# Altium schematic sheet [05] - FLASH.SchDoc
size A3
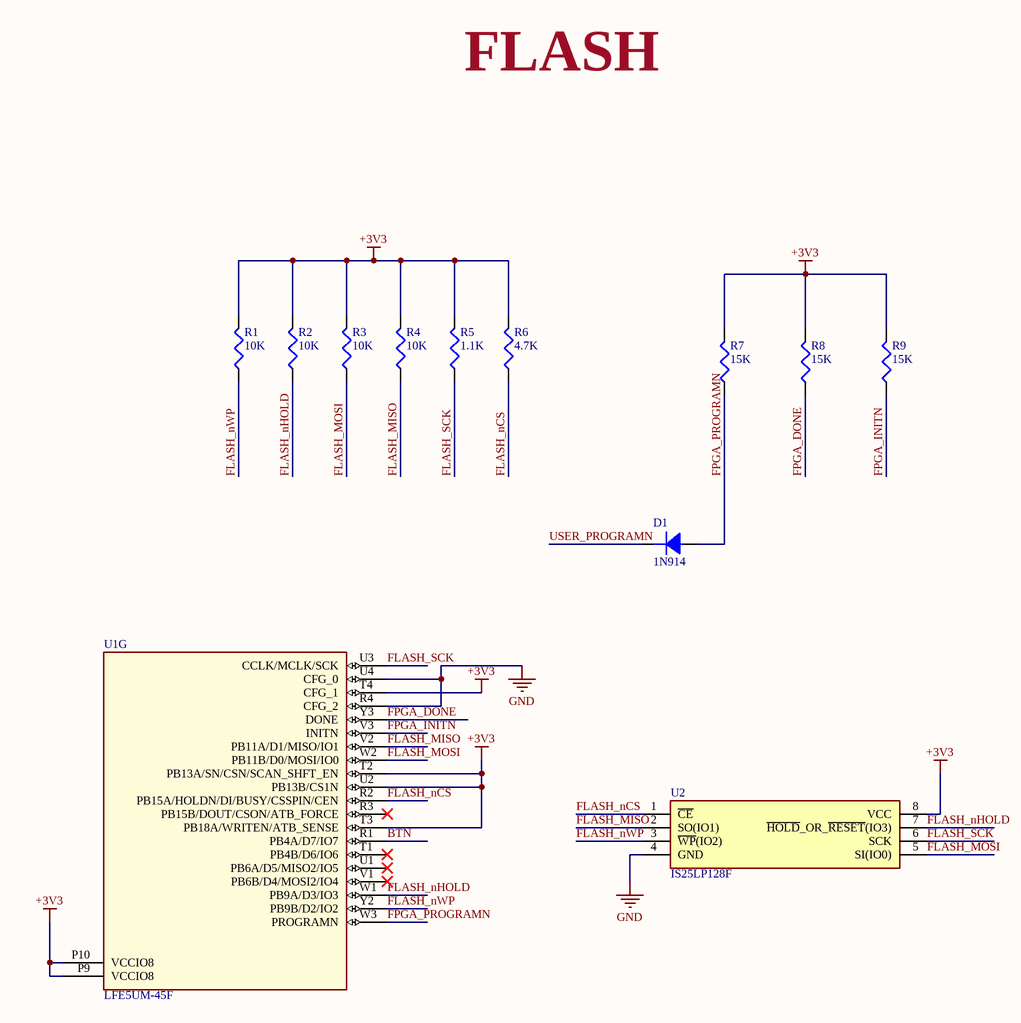
[diagram p0: [05] - FLASH.SchDoc]

## Parts
D1  1N914  [SOD323]
R1  10K  [R0603]
R2  10K  [R0603]
R3  10K  [R0603]
R4  10K  [R0603]
R5  1.1K  [R0603]
R6  4.7K  [R0603]
R7  15K  [R0603]
R8  15K  [R0603]
R9  15K  [R0603]
U1  LFE5UM-45F  [LFE5BG381]  (part G of 11)
U2  IS25LP128F  [SOIC127P790X216-8N]

## Nets
+3V3: R1.2 R2.2 R3.2 R4.2 R5.2 R6.2 R7.2 R8.2 R9.2 U1.P9(VCCIO8) U1.P10(VCCIO8) U1.T2(PB13A/SN/CSN/SCAN_SHFT_EN) U1.T3(PB18A/WRITEN/ATB_SENSE) U1.T4(CFG_1) U1.U2(PB13B/CS1N) U2.8(VCC)
GND: U1.R4(CFG_2) U1.U4(CFG_0) U2.4(GND)
BTN: U1.R1(PB4A/D7/IO7)
FLASH_MISO: R4.1 U1.V2(PB11A/D1/MISO/IO1) U2.2(SO(IO1))
FLASH_MOSI: R3.1 U1.W2(PB11B/D0/MOSI/IO0) U2.5(SI(IO0))
FLASH_nCS: R6.1 U1.R2(PB15A/HOLDN/DI/BUSY/CSSPIN/CEN) U2.1(~{CE})
FLASH_nHOLD: R2.1 U1.W1(PB9A/D3/IO3) U2.7(~{HOLD}_OR_~{RESET}(IO3))
FLASH_nWP: R1.1 U1.Y2(PB9B/D2/IO2) U2.3(~{WP}(IO2))
FLASH_SCK: R5.1 U1.U3(CCLK/MCLK/SCK) U2.6(SCK)
FPGA_DONE: R8.1 U1.Y3(DONE)
FPGA_INITN: R9.1 U1.V3(INITN)
FPGA_PROGRAMN: D1.2(Anode) R7.1 U1.W3(PROGRAMN)
USER_PROGRAMN: D1.1(Cathode)

Not connected (* = marked no-connect by the designer): U1 R3(PB15B/DOUT/CSON/ATB_FORCE)* T1(PB4B/D6/IO6)* U1(PB6A/D5/MISO2/IO5)* V1(PB6B/D4/MOSI2/IO4)*

## Notes on the sheet
- FLASH

## Library data of the parts
D1 = 1N914BWS: ON SEMICONDUCTOR/FAIRCHILD - 1N914BWS. - SMALL SIGNAL DIODE; Forward Current: 150mA; Peak Reverse Current: 5uA; Max Repetitive Reverse Voltage (Vrrm): 75V; Element Configuration: Single; Forward Voltage: 1V; Power Dissipation: 200mW; Reverse Recovery Time: 4ns; Max Forward Surge Current (Ifsm): 4A; Supplier 1: Digi-Key; Manufacturer: ON Semiconductor / Fairchild; Manufacturer Part Number: 1N914BWS; Stock 1: 133438; Pricing 1: 1=0.16, 10=0.147, 25=0.14, 100=0.0616, 250=0.05912, 500=0.04838, 1000=0.0336 (USD); Mount: Surface Mount; Number of Pins: 2; Weight: 0.0276g; Contact Plating: Tin,Matte; Min Operating Temperature: -55°C; Max Operating Temperature: 150°C; Packaging: Tape and Reel; Package Quantity: 1; Average Rectified Current: 150mA; Max Reverse Voltage (DC): 75V; Reverse Voltage: 75V; Recovery Time: 4ns; Length: 1.8mm; Height: 1mm; Width: 1.35mm; Radiation Hardening: No; Lead Free: Lead Free; REACH SVHC: No SVHC; ComponentLink1URL: https://www.fairchildsemi.com/datasheets/1N/1N4148WS.pdf?src-supplier=Digi-Key; ComponentLink1Description: https://www.fairchildsemi.com/datasheets/1N/1N4148WS.pdf?src-supplier=Digi-Key; ComponentLink2URL: https://www.onsemi.com/pub/Collateral/1N914BWS-D.pdf?src-supplier=Digi-Key; ComponentLink2Description: https://www.onsemi.com/pub/Collateral/1N914BWS-D.pdf?src-supplier=Digi-Key; ComponentLink3URL: http://www.fairchildsemi.com/ds/1N/1N914BWS.pdf?src-supplier=Future+Electronics; ComponentLink3Description: http://www.fairchildsemi.com/ds/1N/1N914BWS.pdf?src-supplier=Future+Electronics; ComponentLink4URL: http://www.farnell.com/datasheets/1771770.pdf?src-supplier=Element14; ComponentLink4Description: http://www.farnell.com/datasheets/1771770.pdf?src-supplier=Element14; ComponentLink5URL: https://www.fairchildsemi.com/datasheets/1N/1N914BWS.pdf?src-supplier=Avnet; ComponentLink5Description: https://www.fairchildsemi.com/datasheets/1N/1N914BWS.pdf?src-supplier=Avnet; ComponentLink6URL: http://www.fairchildsemi.com/ds/1N/1N914BWS.pdf?src-supplier=Avnet+Europe; ComponentLink6Description: http://www.fairchildsemi.com/ds/1N/1N914BWS.pdf?src-supplier=Avnet+Europe; Supplier Part Number 1: 1N914BWSDKR-ND
R1-R4 = RC0603FR-0710KL: Res General Purpose Thick Film 0603 10K Ohm 1% 1/10W ±100ppm/°C Molded SMD Paper T/R; Manufacturer: Yageo; Resistance: 10kR; Voltage Rating (DC): 50V; Power Rating: 100mW; Voltage Rating: 75V; Supplier 1: Digi-Key; Manufacturer Part Number: RC0603FR-0710KL; Stock 1: 1155; Pricing 1: 1=0.1, 10=0.023, 100=0.0094, 1000=0.00421, 2500=0.00366 (USD); Case/Package: 0603; Number of Pins: 2; Weight: 7.1E-05oz; Case Code (Imperial): 0603; Case Code (Metric): 1608; Min Operating Temperature: -55°C; Max Operating Temperature: 155°C; Tolerance: 1%; Composition: Thick Film; Temperature Coefficient: 100ppm/°C; Packaging: Tape and Reel; Military Standard: Not; Termination: SMD/SMT; Length: 1.6mm; Height: 0.45mm; Width: 0.8mm; Depth: 0.8mm; Lead Pitch: 0.3mm; REACH SVHC: No SVHC; Lead Free: Lead Free; ComponentLink1URL: http://www.farnell.com/datasheets/38590.pdf?src-supplier=Element14; ComponentLink1Description: http://www.farnell.com/datasheets/38590.pdf?src-supplier=Element14; ComponentLink2URL: https://www.verical.com/server-webapp/html/getDatasheet?partID=409289&src-supplier=Verical; ComponentLink2Description: https://www.verical.com/server-webapp/html/getDatasheet?partID=409289&src-supplier=Verical; ComponentLink3URL: http://www.farnell.com/datasheets/1868787.pdf?src-supplier=Element14; ComponentLink3Description: http://www.farnell.com/datasheets/1868787.pdf?src-supplier=Element14; ComponentLink4URL: http://www.farnell.com/datasheets/2167052.pdf?src-supplier=Element14; ComponentLink4Description: http://www.farnell.com/datasheets/2167052.pdf?src-supplier=Element14; ComponentLink5URL: http://www.farnell.com/datasheets/443971.pdf?src-supplier=Element14; ComponentLink5Description: http://www.farnell.com/datasheets/443971.pdf?src-supplier=Element14; Supplier Part Number 1: 311-10.0KHRDKR-ND
R5 = RC0603FR-071K1L: RES SMD 1.1K OHM 1% 1/10W 0603; Manufacturer: Yageo; Power Rating: 100mW; Temperature Coefficient: 100ppm/°C; Resistance: 1.1kR; Voltage Rating: 50V; Supplier 1: Digi-Key; Manufacturer Part Number: RC0603FR-071K1L; Stock 1: 534181; Pricing 1: 1=0.1, 10=0.023, 100=0.0094, 1000=0.00421, 2500=0.00366 (USD); Case/Package: 0603; Number of Pins: 2; Case Code (Metric): 1608; Case Code (Imperial): 0603; Min Operating Temperature: -55°C; Max Operating Temperature: 155°C; Tolerance: 1%; Package Quantity: 1; Packaging: Tape and Reel; Composition: Thick Film; Number of Terminations: 2; Termination: SMD/SMT; Military Standard: Not; Max Power Dissipation: 100mW; Voltage Rating (DC): 50V; Features: Moisture Resistant; Length: 1.6mm; Height: 0.022inch; Depth: 0.8mm; Width: 0.031inch; REACH SVHC: No SVHC; Lead Free: Lead Free; ComponentLink1URL: http://www.yageo.com/documents/recent/PYu-RC_Group_51_RoHS_L_10.pdf?src-supplier=Digi-Key; ComponentLink1Description: http://www.yageo.com/documents/recent/PYu-RC_Group_51_RoHS_L_10.pdf?src-supplier=Digi-Key; ComponentLink2URL: http://www.yageo.com/documents/recent/PYu-RC_Group_51_RoHS_L_9.pdf?src-supplier=Digi-Key; ComponentLink2Description: http://www.yageo.com/documents/recent/PYu-RC_Group_51_RoHS_L_9.pdf?src-supplier=Digi-Key; Supplier Part Number 1: 311-1.10KHRDKR-ND
R6 = RC0603FR-074K7L: RES SMD 4.7K OHM 1% 1/10W 0603; Manufacturer: Yageo; Resistance: 4.7kR; Temperature Coefficient: 100ppm/°C; Power Rating: 100mW; Voltage Rating (DC): 50V; Supplier 1: Digi-Key; Manufacturer Part Number: RC0603FR-074K7L; Stock 1: 1446473; Pricing 1: 1=0.1, 10=0.023, 100=0.0094, 1000=0.00421, 2500=0.00366 (USD); Case/Package: 0603; Number of Pins: 2; Case Code (Imperial): 0603; Case Code (Metric): 1608; Min Operating Temperature: -55°C; Max Operating Temperature: 155°C; Tolerance: 1%; Composition: Thick Film; Packaging: Tape and Reel; Voltage Rating: 50V; Termination: SMD/SMT; Military Standard: Not; Length: 1.6mm; Height: 0.45mm; Width: 0.8mm; Depth: 0.8mm; Lead Pitch: 0.3mm; REACH SVHC: No SVHC; Lead Free: Lead Free; ComponentLink1URL: https://www.verical.com/server-webapp/html/getDatasheet?partID=422754&src-supplier=Verical; ComponentLink1Description: https://www.verical.com/server-webapp/html/getDatasheet?partID=422754&src-supplier=Verical; ComponentLink2URL: http://www.farnell.com/datasheets/2167052.pdf?src-supplier=Element14; ComponentLink2Description: http://www.farnell.com/datasheets/2167052.pdf?src-supplier=Element14; ComponentLink3URL: http://www.farnell.com/datasheets/38590.pdf?src-supplier=Element14; ComponentLink3Description: http://www.farnell.com/datasheets/38590.pdf?src-supplier=Element14; ComponentLink4URL: http://www.farnell.com/datasheets/1868787.pdf?src-supplier=Element14; ComponentLink4Description: http://www.farnell.com/datasheets/1868787.pdf?src-supplier=Element14; Supplier Part Number 1: 311-4.70KHRCT-ND
R7-R9 = RC0603FR-0715KL: Res Thick Film 0603 15K Ohm 1% 1/10W ?100ppm/?C Molded SMD Paper T/R; Manufacturer: Yageo; Temperature Coefficient: 100ppm/°C; Resistance: 15kR; Power Rating: 100mW; Voltage Rating (DC): 50V; Supplier 1: Digi-Key; Manufacturer Part Number: RC0603FR-0715KL; Stock 1: 3342455; Pricing 1: 1=0.1, 10=0.023, 100=0.0094, 1000=0.00421, 2500=0.00366 (USD); Case/Package: 0603; Number of Pins: 2; Case Code (Metric): 1608; Case Code (Imperial): 0603; Min Operating Temperature: -55°C; Max Operating Temperature: 155°C; Tolerance: 1%; Composition: Thick Film; Packaging: Tape and Reel; Package Quantity: 1; Voltage Rating: 50V; Number of Terminations: 2; Termination: SMD/SMT; Military Standard: Not; Max Power Dissipation: 100mW; Features: Moisture Resistant; Length: 1.6mm; Height: 0.022inch; Width: 0.031inch; Depth: 0.8mm; Lead Free: Lead Free; REACH SVHC: Unknown; ComponentLink1URL: http://www.yageo.com/documents/recent/PYu-RC_Group_51_RoHS_L_10.pdf?src-supplier=Digi-Key; ComponentLink1Description: http://www.yageo.com/documents/recent/PYu-RC_Group_51_RoHS_L_10.pdf?src-supplier=Digi-Key; ComponentLink2URL: http://www.yageo.com/documents/recent/PYu-RC_Group_51_RoHS_L_9.pdf?src-supplier=Digi-Key; ComponentLink2Description: http://www.yageo.com/documents/recent/PYu-RC_Group_51_RoHS_L_9.pdf?src-supplier=Digi-Key; ComponentLink3URL: https://www.verical.com/server-webapp/html/getDatasheet?partID=327895&src-supplier=Verical; ComponentLink3Description: https://www.verical.com/server-webapp/html/getDatasheet?partID=327895&src-supplier=Verical; Supplier Part Number 1: 311-15.0KHRCT-ND
U1 = LFE5UM-45F-6BG381C: ECP5 Series 44 K LUTs 203 I/O 1.1 V Slow Surface Mount FPGA - CABGA-381; Manufacturer: Lattice Semiconductor; Number of Logic Blocks (LABs): 11000; Number of Logic Elements/Cells: 44000; RAM Size: 1990656b; Number of I/Os: 203; Supplier 1: Digi-Key; Manufacturer Part Number: LFE5UM-45F-6BG381C; Stock 1: 0; Pricing 1: 90=19.13967 (USD); Mount: Surface Mount; Case/Package: FBGA; Min Operating Temperature: 0°C; Max Operating Temperature: 85°C; Lead Free: Lead Free; ComponentLink1URL: http://www.latticesemi.com/~/media/LatticeSemi/Documents/DataSheets/ECP5/DS1044.pdf?src-supplier=Digi-Key; ComponentLink1Description: http://www.latticesemi.com/~/media/LatticeSemi/Documents/DataSheets/ECP5/DS1044.pdf?src-supplier=Digi-Key; Supplier Part Number 1: 220-1994-ND
U2 = IS25LP128F-JBLE: IC FLASH 128M SPI 133MHZ 8SOIC; Manufacturer: ISSI; Memory Type: Non-Volatile,FLASH; Memory Size: 128Mb; Supplier 1: Digi-Key; Manufacturer Part Number: IS25LP128F-JBLE; Stock 1: 0; Pricing 1: 540=1.7662 (USD); Mount: Surface Mount; Case/Package: SOIC; Min Operating Temperature: -40°C; Max Operating Temperature: 105°C; Frequency: 133MHz; ComponentLink1URL: http://www.farnell.com/datasheets/2625717.pdf?src-supplier=Farnell; ComponentLink1Description: http://www.farnell.com/datasheets/2625717.pdf?src-supplier=Farnell; ComponentLink2URL: http://www.farnell.com/datasheets/2625717.pdf?src-supplier=Newark; ComponentLink2Description: http://www.farnell.com/datasheets/2625717.pdf?src-supplier=Newark; ComponentLink3URL: http://www.issi.com/WW/pdf/25LP-WP128F.pdf?src-supplier=Digi-Key; ComponentLink3Description: http://www.issi.com/WW/pdf/25LP-WP128F.pdf?src-supplier=Digi-Key; Supplier Part Number 1: IS25LP128F-JBLE-ND